# EAGLE design DECADE-PwmduinoV1 (EAGLE 6.3)
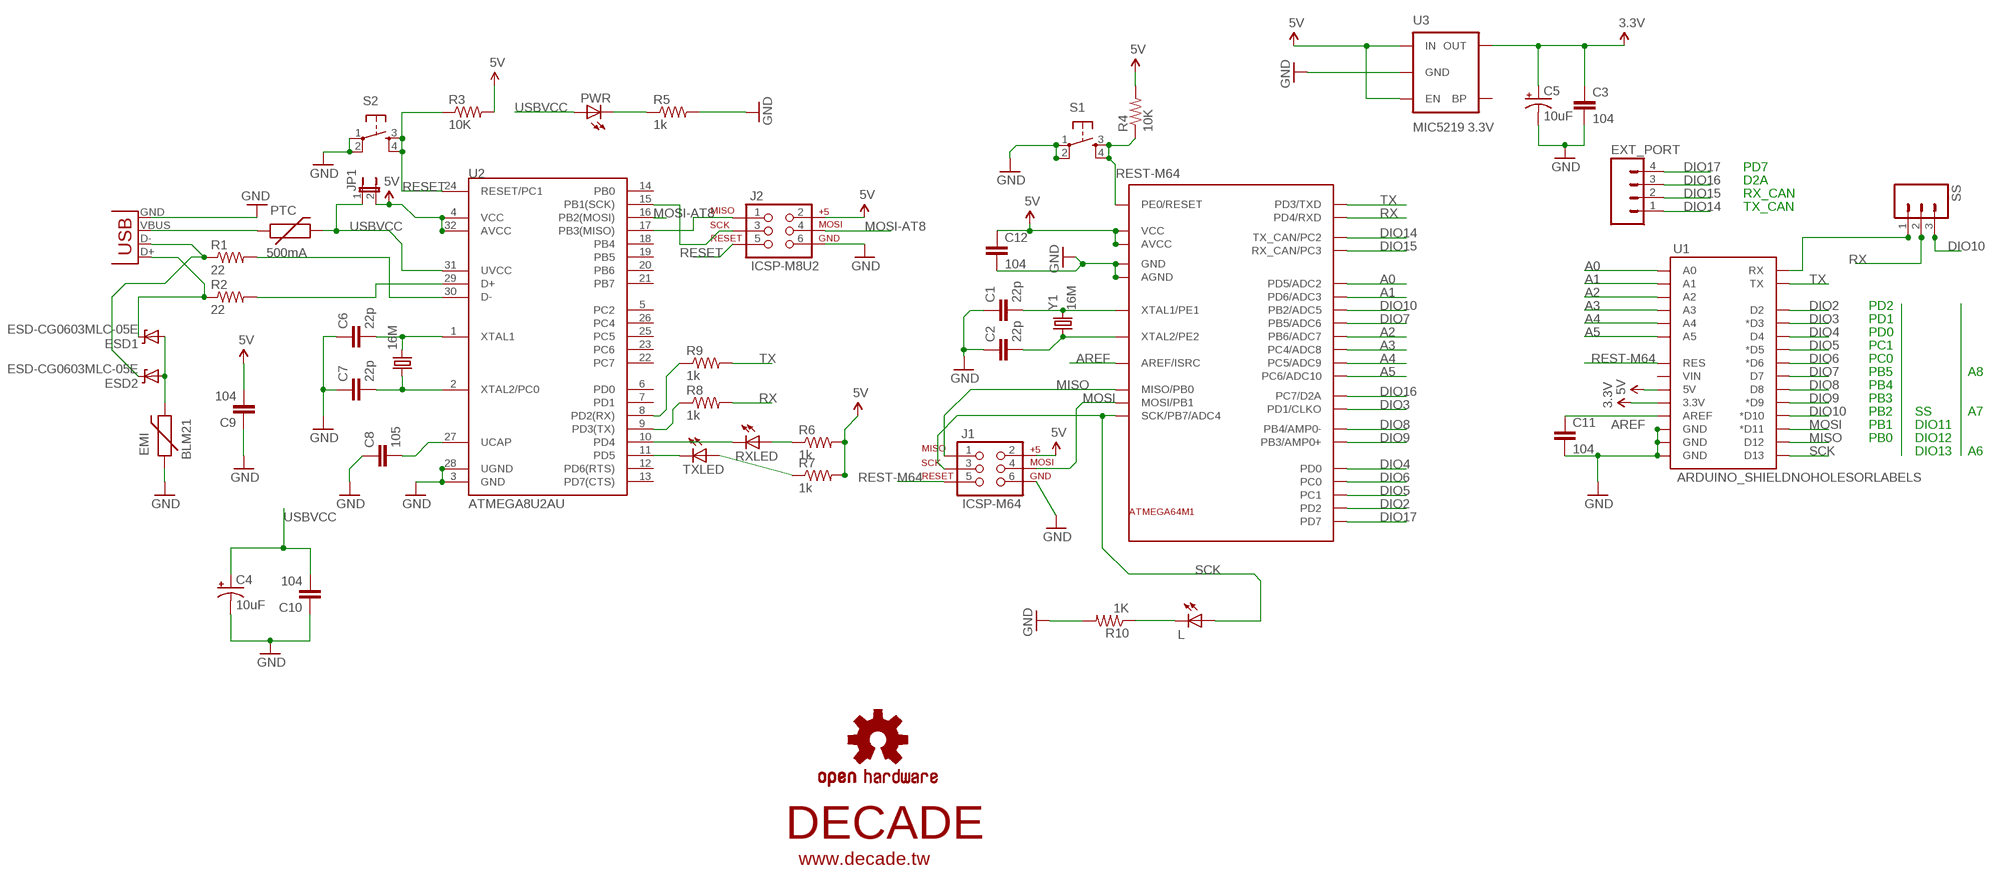
[diagram p0: schematic, sheet 1]

## Parts
16M  CRYSTAL5X3  [CRYSTAL-SMD-5X3]
C1  22p  CAP0603-CAP  [0603-CAP]
C2  22p  CAP0603-CAP  [0603-CAP]
C3  104  CAP0603-CAP  [0603-CAP]
C4  10uF  CAP_POL1206-KIT  [EIA3216-KIT]
C5  10uF  CAP_POL1206-KIT  [EIA3216-KIT]
C6  22p  CAP0603-CAP  [0603-CAP]
C7  22p  CAP0603-CAP  [0603-CAP]
C8  105  CAP0603-CAP  [0603-CAP]
C9  104  CAP0603-CAP  [0603-CAP]
C10  104  CAP0603-CAP  [0603-CAP]
C11  104  CAP0603-CAP  [0603-CAP]
C12  104  CAP0603-CAP  [0603-CAP]
EMI  BLM21  PTCSMD  [PTC-1206]
ESD1  ESD-CG0603MLC-05E  DIODE-ZENER-BZT52  [SOD-323]
ESD2  ESD-CG0603MLC-05E  DIODE-ZENER-BZT52  [SOD-323]
EXT_PORT  M04LOCK  [1X04_LOCK]
J1  ICSP-M64  AVR_SPI_PRG_62X3_LOCK  [2X3_LOCK]
J2  ICSP-M8U2  AVR_SPI_PRG_62X3_LOCK  [2X3_LOCK]
JP1  JUMPER-2SMD-NO  [SJ_2S-NO]
L  LEDCHIP-LED0603  [CHIP-LED0603]
LOGO1  OSHW-LOGOL  [OSHW-LOGO-L]
PTC  500mA  SPARKFUN_PTCSMD  [SPARKFUN_PTC-1206]
PWR  LEDCHIP-LED0603  [CHIP-LED0603]
R1  22  SPARKFUN_RESISTOR0603-RES  [SPARKFUN_0603-RES]
R2  22  SPARKFUN_RESISTOR0603-RES  [SPARKFUN_0603-RES]
R3  10K  SPARKFUN_RESISTOR0603-RES  [SPARKFUN_0603-RES]
R4  10K  SPARKFUN_RESISTOR0603-RES  [SPARKFUN_0603-RES]
R5  1k  SPARKFUN_RESISTOR0603-RES  [SPARKFUN_0603-RES]
R6  1k  SPARKFUN_RESISTOR0603-RES  [SPARKFUN_0603-RES]
R7  1k  SPARKFUN_RESISTOR0603-RES  [SPARKFUN_0603-RES]
R8  1k  SPARKFUN_RESISTOR0603-RES  [SPARKFUN_0603-RES]
R9  1k  SPARKFUN_RESISTOR0603-RES  [SPARKFUN_0603-RES]
R10  1K  SPARKFUN_RESISTOR0603-RES  [SPARKFUN_0603-RES]
RXLED  LEDCHIP-LED0603  [CHIP-LED0603]
S1  TAC_SWITCHPTH  [TACTILE-PTH]
S2  TAC_SWITCHSMD  [TACTILE_SWITCH_SMD]
SS  M03LOCK  [1X03_LOCK]
TXLED  LEDCHIP-LED0603  [CHIP-LED0603]
U1  ARDUINO_SHIELDNOHOLESORLABELS  [DUEMILANOVE_SHIELD_NOHOLES_NOLABELS]
U2  ATMEGA8U2AU  [TQFP32-08]
U3  MIC5219 3.3V  V_REG_MIC52193.3V  [SOT23-5]
U$1  DECADE-ATMEGA64M1  [DECADE-QFN-32]
U$2  DECADE-LOGO-SMALL  [DECADE-LOGO-SMALL]
X1  SPARKFUN_USBOLD  [SPARKFUN_USB-MINIB-OLD]
Y1  16M  CRYSTAL5X3  [CRYSTAL-SMD-5X3]

## Nets
3.3V: C3.1 C5.A(+) U1.3.3V U3.5(OUT)
5V: C9.2 C12.1 J1.2 J2.2 JP1.2 R3.2 R4.2 R6.2 R7.2 U1.5V U2.4(VCC) U2.32(AVCC) U3.1(IN) U3.3(EN) U$1.4(VCC) U$1.19(AVCC)
A0: U1.A0 U$1.13(PD5/ADC2)
A1: U1.A1 U$1.14(PD6/ADC3)
A2: U1.A2 U$1.27(PB6/ADC7)
A3: U1.A3 U$1.17(PC4/ADC8)
A4: U1.A4 U$1.18(PC5/ADC9)
A5: U1.A5 U$1.22(PC6/ADC10)
AREF: C11.1 U1.AREF U$1.21(AREF/ISRC)
DIO2: U1.D2 U$1.1(PD2)
DIO3: U1.D3(*D3) U$1.32(PD1/CLKO)
DIO4: U1.D4 U$1.29(PD0)
DIO5: U1.D5(*D5) U$1.3(PC1)
DIO6: U1.D6(*D6) U$1.30(PC0)
DIO7: U1.D7 U$1.26(PB5/ADC6)
DIO8: U1.D8 U$1.24(PB4/AMP0-)
DIO9: U1.D9(*D9) U$1.23(PB3/AMP0+)
DIO10: SS.3 U1.D10(*D10) U$1.16(PB2/ADC5)
DIO14: EXT_PORT.1 U$1.6(TX_CAN/PC2)
DIO15: EXT_PORT.2 U$1.7(RX_CAN/PC3)
DIO16: EXT_PORT.3 U$1.25(PC7/D2A)
DIO17: EXT_PORT.4 U$1.15(PD7)
GND: C1.1 C2.1 C3.2 C4.C(-) C5.C(-) C6.1 C7.1 C8.1 C9.1 C10.1 C11.2 C12.2 EMI.1 J1.6 J2.6 R5.2 R10.2 S1.1 S1.2 S2.1 S2.2 U1.GND@0(GND) U1.GND@1(GND) U1.GND@2(GND) U2.3(GND) U2.28(UGND) U3.2(GND) U$1.5(GND) U$1.20(AGND) X1.GND
MISO: J1.1 U1.D12 U$1.8(MISO/PB0)
MOSI: J1.4 U1.D11(*D11) U$1.9(MOSI/PB1)
MOSI-AT8: J2.4 U2.16(PB2(MOSI))
N$1: PTC.1 X1.VBUS
N$2: 16M.3 C6.2 U2.1(XTAL1)
N$3: 16M.1 C7.2 U2.2(XTAL2/PC0)
N$4: EMI.2 ESD1.2(A) ESD2.2(A)
N$5: ESD2.1(C) R1.1 X1.D-
N$6: ESD1.1(C) R2.1 X1.D+
N$7: R1.2 U2.30(D-)
N$8: R2.2 U2.29(D+)
N$9: C2.2 U$1.11(XTAL2/PE2) Y1.1
N$10: C8.2 U2.27(UCAP)
N$11: C1.2 U$1.10(XTAL1/PE1) Y1.3
N$12: J2.1 U2.17(PB3(MISO))
N$13: J2.3 U2.15(PB1(SCK))
N$14: PWR.C R5.1
N$15: TXLED.C U2.11(PD5)
N$19: RXLED.C U2.10(PD4)
N$20: R6.1 RXLED.A
N$21: R7.1 TXLED.A
N$23: R9.1 U2.8(PD2(RX))
N$24: R8.1 U2.9(PD3(TX))
N$25: SS.1 U1.RX
N$45: L.C R10.1
RESET: J2.5 R3.1 S2.3 S2.4 U2.24(RESET/PC1)
REST-M64: J1.5 R4.1 S1.3 S1.4 U1.RES U$1.31(PE0/RESET)
RX: R8.2 SS.2 U$1.12(PD4/RXD)
SCK: J1.3 L.A U1.D13 U$1.28(SCK/PB7/ADC4)
TX: R9.2 U1.TX U$1.2(PD3/TXD)
USBVCC: C4.A(+) C10.2 JP1.1 PTC.2 PWR.A U2.31(UVCC)
Unconnected: U1.VIN U2.5(PC2) U2.6(PD0) U2.7(PD1) U2.12(PD6(RTS)) U2.13(PD7(CTS)) U2.14(PB0) U2.18(PB4) U2.19(PB5) U2.20(PB6) U2.21(PB7) U2.22(PC7) U2.23(PC6) U2.25(PC5) U2.26(PC4) U3.4(BP)

## Notes on the sheet
- PD7
- D2A
- RX_CAN
- TX_CAN
- PD2
- PD1
- PD0
- PC1
- PC0
- PB5 | A8
- PB4
- PB3
- PB2 | SS | A7
- PB1 | DIO11
- PB0 | DIO12
- DIO13 | A6

## Library data of the parts
16M Y1 = SparkFun-FreqCtrl:CRYSTAL: Various standard crystals. Proven footprints. Spark Fun Electronics SKU : COM-00534
C1-C3 C6-C12 = SparkFun-Capacitors:CAP: Capacitor Standard 0603 ceramic capacitor, and 0.1" leaded capacitor.
C4 C5 = SparkFun-Capacitors:CAP_POL: Capacitor Polarized These are standard SMD and PTH capacitors. Normally 10uF, 47uF, and 100uF in electrolytic and tantalum varieties. Always verify the external diameter of the through hole cap, it varies with capacity, voltage, and manufacturer. The EIA devices should be standard.
EMI = SparkFun-PowerIC:PTC: Resettable Fuse PTC Resettable Fuse. Spark Fun Electronics SKU : COM-08357
ESD1 ESD2 = SparkFun-DiscreteSemi:DIODE-ZENER: Zener Diode Production Part - 8199 3.4V Zener Voltage
EXT_PORT = SparkFun-Connectors:M04: Header 4 Standard 4-pin 0.1" header. Use with straight break away headers (SKU : PRT-00116), right angle break away headers (PRT-00553), swiss pins (PRT-00743), machine pins (PRT-00117), and female headers (PRT-00115). Molex polarized connector foot print use with SKU : PRT-08231 with associated crimp pins and housings. 1MM SMD Version SKU: PRT-10208
J1 J2 = SparkFun-Connectors:AVR_SPI_PRG_6: AVR ISP 6 Pin This is the reduced ISP connector for AVR programming. Common on Arduino. This footprint will take up less PCB space and can be used with a 10-pin to 6-pin adapter such as SKU: BOB-08508
JP1 = SparkFun-Passives:JUMPER-2: Jumper Basic 0.1" spaced jumper. Use with breakaway headers.
L PWR RXLED TXLED = led:LED: LED OSRAM: - CHIPLED LG R971, LG N971, LY N971, LG Q971, LY Q971, LO R971, LY R971 LH N974, LH R974 LS Q976, LO Q976, LY Q976 LO Q996 - Hyper CHIPLED LW Q18S LB Q993, LB Q99A, LB R99A - SideLED LS A670, LO A670, LY A670, LG A670, LP A670 LB A673, LV A673, LT A673, LW A673 LH A674 LY A675 LS A676, LA A676, LO A676, LY A676, LW A676 LS A679, LY A679, LG A679 - Hyper Micro SIDELED® LS Y876, LA Y876, LO Y876, LY Y876 LT Y87S - SmartLED LW L88C, LW L88S LB L89C, LB L89S, LG L890 LS L89K, LO L89K, LY L89K LS L896, LA L896, LO L896, LY L896 - TOPLED LS T670, LO T670, LY T670, LG T670, LP T670 LSG T670, LSP T670, LSY T670, LOP T670, LYG T670 LG T671, LOG T671, LSG T671 LB T673, LV T673, LT T673, LW T673 LH T674 LS T676, LA T676, LO T676, LY T676, LB T676, LH T676, LSB T676, LW T676 LB T67C, LV T67C, LT T67C, LS T67K, LO T67K, LY T67K, LW E67C LS E67B, LA E67B, LO E67B, LY E67B, LB E67C, LV E67C, LT E67C LW T67C LS T679, LY T679, LG T679 LS T770, LO T770, LY T770, LG T770, LP T770 LB T773, LV T773, LT T773, LW T773 LH T774 LS E675, LA E675, LY E675, LS T675 LS T776, LA T776, LO T776, LY T776, LB T776 LHGB T686 LT T68C, LB T68C - Hyper Mini TOPLED® LB M676 - Mini TOPLED Santana® LG M470 LS M47K, LO M47K, LY M47K Source: http://www.osram.convergy.de LUXEON: - LUMILED® LXK2-PW12-R00, LXK2-PW12-S00, LXK2-PW14-U00, LXK2-PW14-V00 LXK2-PM12-R00, LXK2-PM12-S00, LXK2-PM14-U00 LXK2-PE12-Q00, LXK2-PE12-R00, LXK2-PE12-S00, LXK2-PE14-T00, LXK2-PE14-U00 LXK2-PB12-K00, LXK2-PB12-L00, LXK2-PB12-M00, LXK2-PB14-N00, LXK2-PB14-P00, LXK2-PB14-Q00 LXK2-PR12-L00, LXK2-PR12-M00, LXK2-PR14-Q00, LXK2-PR14-R00 LXK2-PD12-Q00, LXK2-PD12-R00, LXK2-PD12-S00 LXK2-PH12-R00, LXK2-PH12-S00 LXK2-PL12-P00, LXK2-PL12-Q00, LXK2-PL12-R00 Source: www.luxeon.com KINGBRIGHT: KA-3528ASYC Source: www.kingbright.com
LOGO1 = SparkFun-Aesthetics:OSHW-LOGO: Open Source Hardware Logo This logo indicates the piece of hardware it is found on incorporates a OSHW license and/or adheres to the definition of open source hardware found here: http://freedomdefined.org/OSHW
PTC = DECADE-libraries:SPARKFUN_PTC: Resettable Fuse PTC Resettable Fuse. Spark Fun Electronics SKU : COM-08357
R1-R10 = DECADE-libraries:SPARKFUN_RESISTOR: Resistor Basic schematic elements and footprints for 0603, 1206, and PTH resistors.
S1 = SparkFun-Electromechanical:TAC_SWITCH: Momentary Switch Button commonly used for reset or general input. Spark Fun Electronics SKU : COM-00097 SMT- SWCH-08247
S2 = SparkFun-Electromechanical:TAC_SWITCH: Momentary Switch Button commonly used for reset or general input. Spark Fun Electronics SKU : COM-00097 SMT- SWCH-08247; PROD_ID: SWCH-08247
SS = SparkFun-Connectors:M03: Header 3 Standard 3-pin 0.1" header. Use with straight break away headers (SKU : PRT-00116), right angle break away headers (PRT-00553), swiss pins (PRT-00743), machine pins (PRT-00117), and female headers (PRT-00115). Molex polarized connector foot print use with SKU : PRT-08232 with associated crimp pins and housings.
U1 = SparkFun-Boards:ARDUINO_SHIELD: Arduino shield footprint
U2 = SparkFun-DigitalIC:ATMEGA8U2: Atmel 32-pin 8-bit Microcontroller with 8/16/32K Bystes of ISP Flash and USB Controller. ATmega8U2, ATmega16U2, and ATmega32U2
U3 = SparkFun-PowerIC:V_REG_MIC5219: V_REG MIC5219 Standard 500mA LDO voltage regulator in SOT-23 layout. Micrel part MIC5219. BP (by-pass) pin is used to lower output noise with 470pF cap, may be left open.; PROD_ID: VREG-09872
U$1 = DECADE-libraries:DECADE-ATMEGA64M1
U$2 = DECADE-libraries:DECADE-LOGO-SMALL
X1 = DECADE-libraries:SPARKFUN_USB: USB Connectors USB-B-PTH is fully proven SKU : PRT-00139 USB-miniB is fully proven SKU : PRT-00587 USB-A-PCB is untested. USB-A-H is throughly reviewed, but untested. Spark Fun Electronics SKU : PRT-00437 USB-B-SMT is throughly reviewed, but untested. Needs silkscreen touching up. USB-A-S has not been used/tested USB-MB-H has not been used/tested

## Board
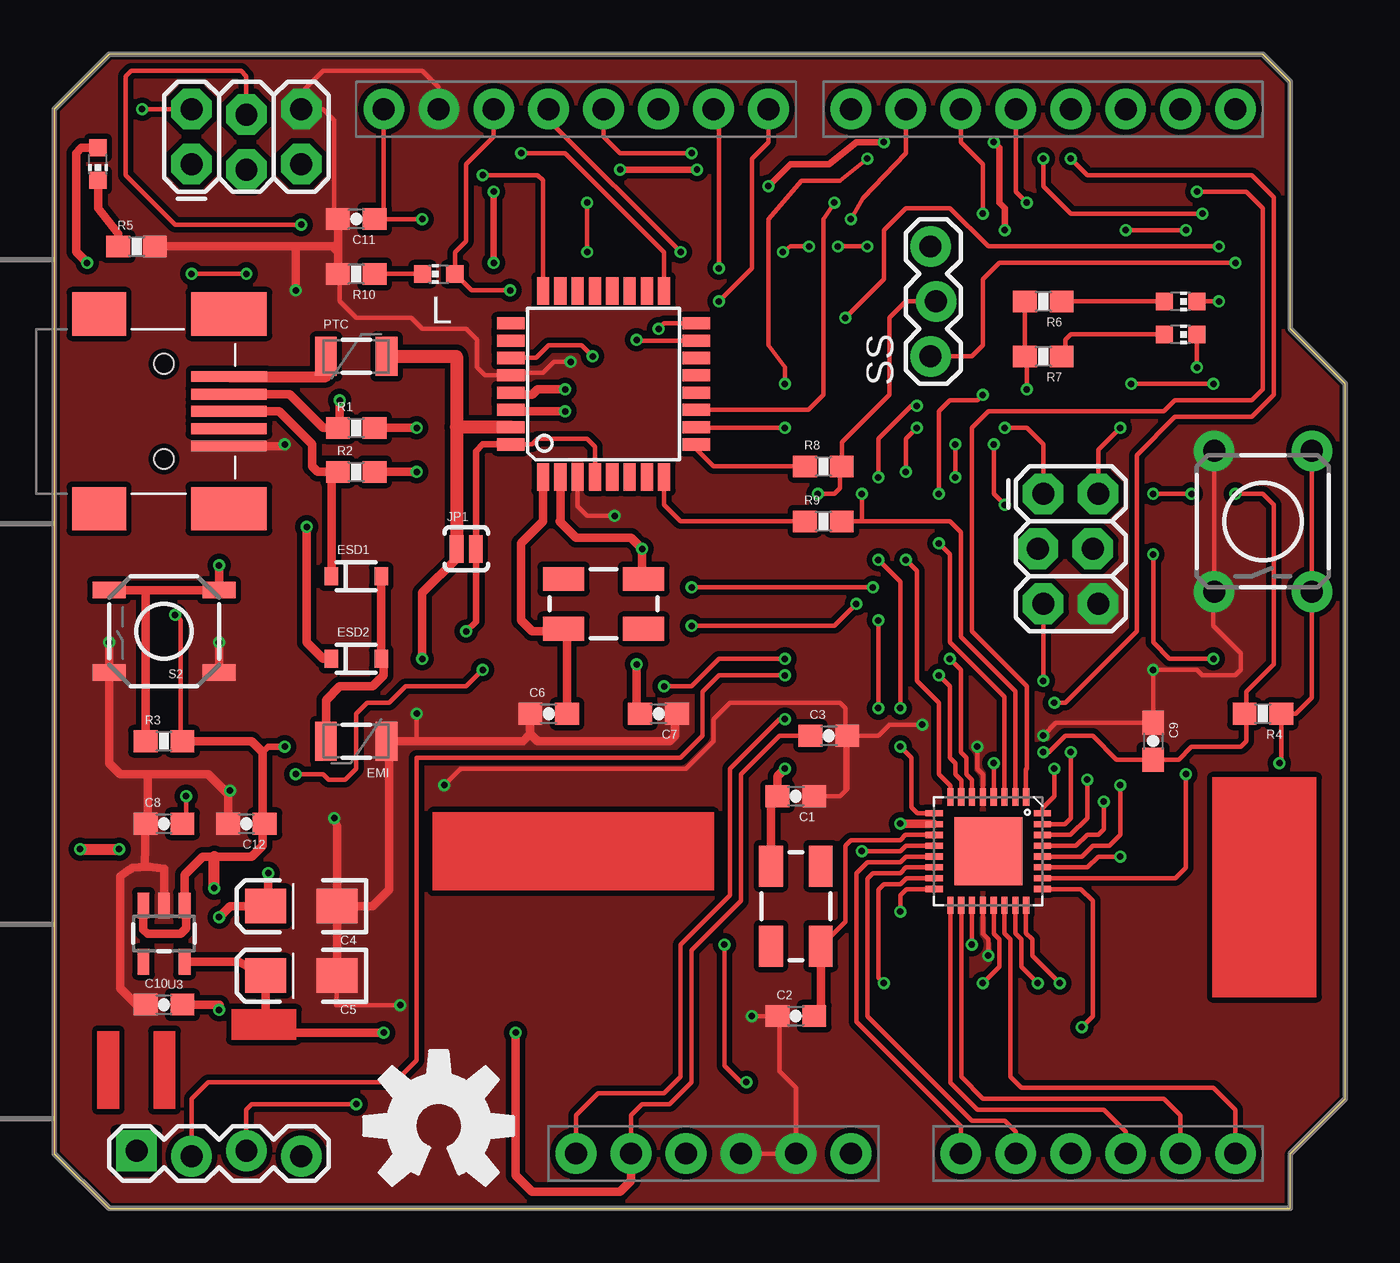
[diagram p1: board, top side]
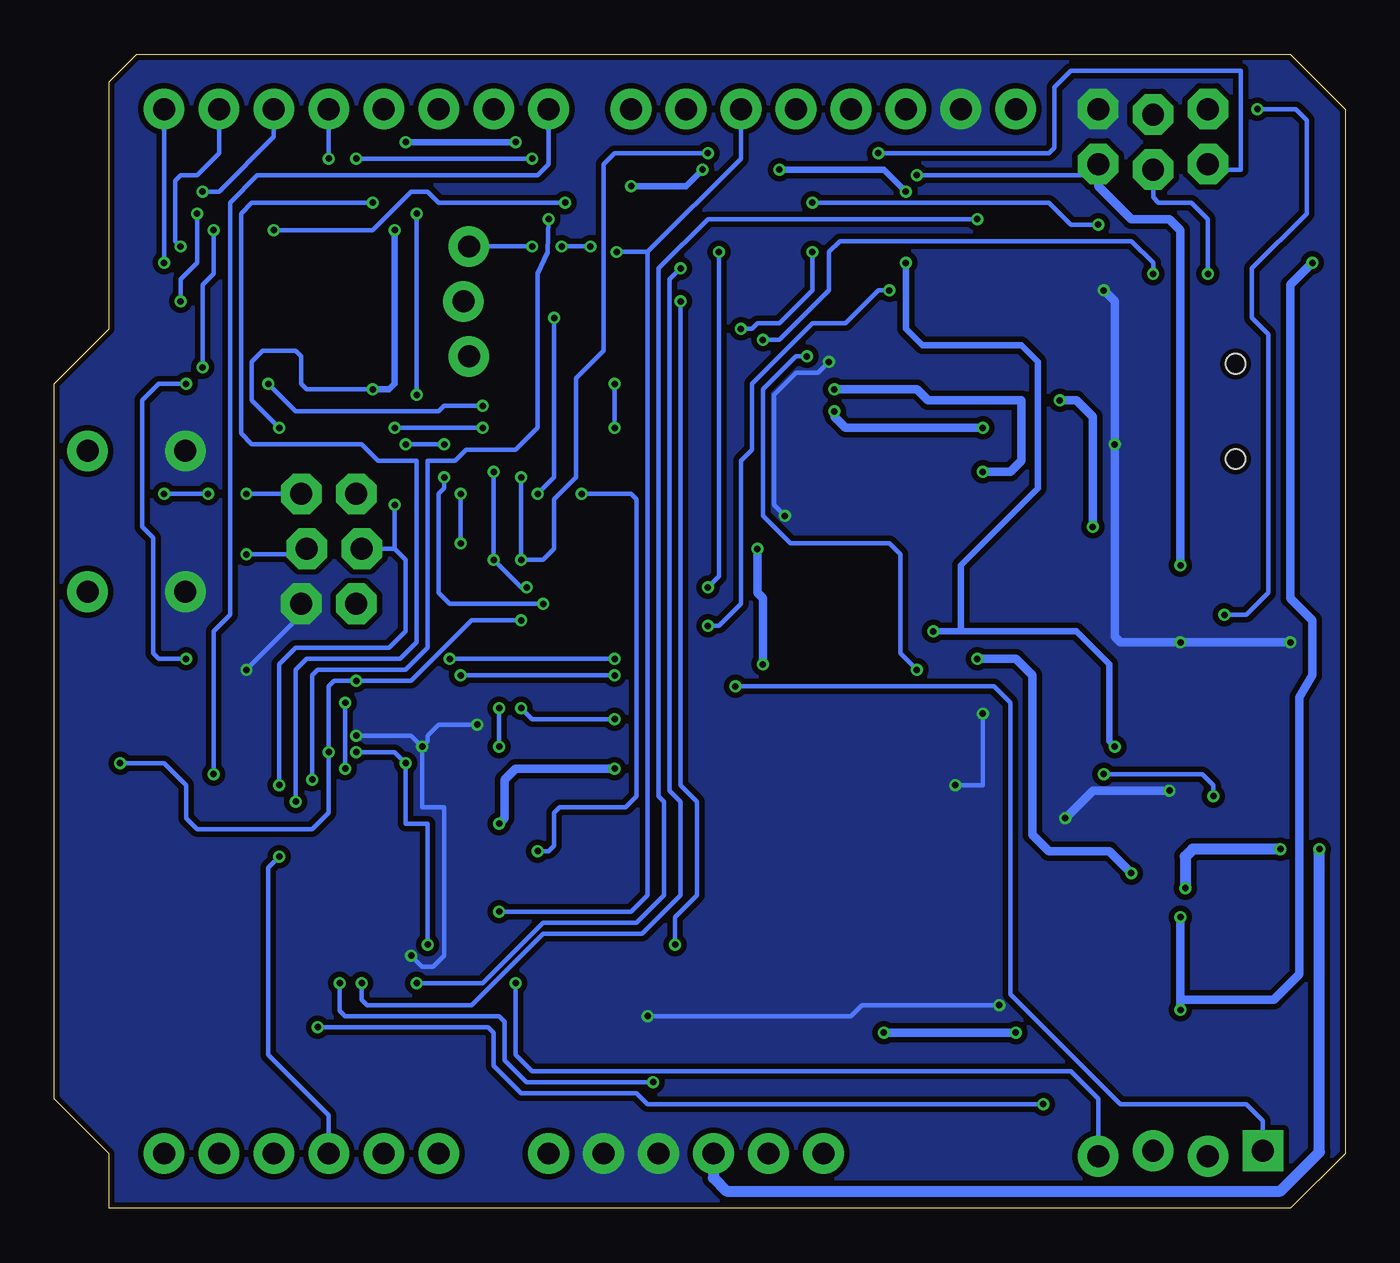
[diagram p2: board, bottom side, seen from below]

Size 59.69 x 53.34 mm. Coordinates in mm from the lower left corner, seen from the top.
Outline: 0,2.54 2.54,0 57.15,0 57.15,2.54 59.69,5.08 59.69,38.1 57.15,40.64 57.15,52.07 55.88,53.34 2.54,53.34 0,50.8 0,2.54
Copper layers (1*16): Top 0.035mm / dielectric 1.5mm / Bottom 0.035mm
Design rules "ChinaPCB-2013-4mil *": minimum track width 4mil, minimum drill 8mil, track to track 4mil, track to pad 4mil, pad to pad 4mil, via to via 4mil, smd to smd 4mil, copper to edge 4mil, drill to drill 15mil, minimum pad ring 12mil, minimum via ring 5mil, stop-mask expansion 4mil, vias tented up to drill 12mil, thermal gap 10mil

### Footprints (pad centres in the part's own frame; a part is rotated, then mirrored left to right if it is on the bottom)
CRYSTAL-SMD-5X3 = smd 1.9 x 1.1: 1 -1.85,-1.15; 2 1.85,-1.15; 3 1.85,1.15; 4 -1.85,1.15
0603-CAP = smd 1.1 x 1: 1 -0.85,0; 2 0.85,0
EIA3216-KIT = smd 1.9 x 1.6: A 1.65,0; C -1.65,0
PTC-1206 = smd 1 x 1.8: 1 -1.4,0; 2 1.4,0
SOD-323 = smd 0.63 x 0.83: 1 -1.15,0; 2 1.15,0
1X04_LOCK = drill 1.016 pad 1.88 square: 1 0,0.127 | drill 1.016 pad 1.88: 2 2.54,-0.127; 3 5.08,0.127; 4 7.62,-0.127
2X3_LOCK = drill 1.016 pad 1.88 octagon: 1 0,0; 2 0,2.54; 3 2.54,-0.254; 4 2.54,2.286; 5 5.08,0; 6 5.08,2.54
SJ_2S-NO = smd 0.635 x 1.27: 1 -0.45,0; 2 0.45,0
CHIP-LED0603 = smd 0.8 x 0.8: A 0,-0.75; C 0,0.75
SPARKFUN_PTC-1206 = smd 1 x 1.8: 1 -1.4,0; 2 1.4,0
SPARKFUN_0603-RES = smd 1.1 x 1: 1 -0.85,0; 2 0.85,0
TACTILE-PTH = drill 1.016 pad 1.88: 1 -3.251,2.261; 2 3.251,2.261; 3 -3.251,-2.261; 4 3.251,-2.261
TACTILE_SWITCH_SMD = smd 1.524 x 0.762: 1 -2.54,1.905; 2 2.54,1.905; 3 -2.54,-1.905; 4 2.54,-1.905
1X03_LOCK = drill 1.016 pad 1.88: 1 0,0.127; 2 2.54,-0.127; 3 5.08,0.127
DUEMILANOVE_SHIELD_NOHOLES_NOLABELS = drill 1.016 pad 1.88: 3.3V 50.8,26.67; 5V 50.8,29.21; A0 50.8,41.91; A1 50.8,44.45; A2 50.8,46.99; A3 50.8,49.53; A4 50.8,52.07; A5 50.8,54.61; AREF 2.54,15.24; D2 2.54,49.53; D3 2.54,46.99; D4 2.54,44.45; D5 2.54,41.91; D6 2.54,39.37; D7 2.54,36.83; D8 2.54,33.02; D9 2.54,30.48; D10 2.54,27.94; D11 2.54,25.4; D12 2.54,22.86; D13 2.54,20.32; GND@0 50.8,31.75; GND@1 50.8,34.29; GND@2 2.54,17.78; RES 50.8,24.13; RX 2.54,54.61; TX 2.54,52.07; VIN 50.8,36.83
TQFP32-08 = smd 1.27 x 0.559: 1 -4.293,2.8; 2 -4.293,2; 3 -4.293,1.2; 4 -4.293,0.4; 5 -4.293,-0.4; 6 -4.293,-1.2; 7 -4.293,-2; 8 -4.293,-2.8; 17 4.293,-2.8; 18 4.293,-2; 19 4.293,-1.2; 20 4.293,-0.4; 21 4.293,0.4; 22 4.293,1.2; 23 4.293,2; 24 4.293,2.8 | smd 0.559 x 1.27: 9 -2.8,-4.293; 10 -2,-4.293; 11 -1.2,-4.293; 12 -0.4,-4.293; 13 0.4,-4.293; 14 1.2,-4.293; 15 2,-4.293; 16 2.8,-4.293; 25 2.8,4.293; 26 2,4.293; 27 1.2,4.293; 28 0.4,4.293; 29 -0.4,4.293; 30 -1.2,4.293; 31 -2,4.293; 32 -2.8,4.293
SOT23-5 = smd 0.55 x 1.2: 1 -0.95,-1.3; 2 0,-1.3; 3 0.95,-1.3; 4 0.95,1.3; 5 -0.95,1.3
DECADE-QFN-32 = smd 0.285 x 0.8: 1 -1.75,-2.5; 2 -1.25,-2.5; 3 -0.75,-2.5; 4 -0.25,-2.5; 5 0.25,-2.5; 6 0.75,-2.5; 7 1.25,-2.5; 8 1.75,-2.5; 17 1.75,2.5; 18 1.25,2.5; 19 0.75,2.5; 20 0.25,2.5; 21 -0.25,2.5; 22 -0.75,2.5; 23 -1.25,2.5; 24 -1.75,2.5 | smd 0.8 x 0.285: 9 2.5,-1.75; 10 2.5,-1.25; 11 2.5,-0.75; 12 2.5,-0.25; 13 2.5,0.25; 14 2.5,0.75; 15 2.5,1.25; 16 2.5,1.75; 25 -2.5,1.75; 26 -2.5,1.25; 27 -2.5,0.75; 28 -2.5,0.25; 29 -2.5,-0.25; 30 -2.5,-0.75; 31 -2.5,-1.25; 32 -2.5,-1.75 | smd 3.15 x 3.15: EP 0,0
SPARKFUN_USB-MINIB-OLD = smd 2.5 x 2: 1 -3,-4.5; 2 -3,4.5 | smd 3.5 x 2: 3 3,-4.5; 4 3,4.5 | smd 3.5 x 0.5: D+ 3,0; D- 3,0.8; GND 3,-1.6; ID 3,-0.8; VBUS 3.01,1.61 | hole 0.9: 0,2.2; 0,-2.2

### Placement (x,y rotation side)
16M  25.4,27.94 180 top
C1  34.29,19.05 180 top
C2  34.29,8.89 0 top
C3  35.81,21.84 0 top
C4  11.43,13.97 180 top
C5  11.43,10.76 180 top
C6  22.86,22.86 0 top
C7  27.94,22.86 180 top
C8  5.08,17.78 0 top
C9  50.8,21.59 270 top
C10  5.08,9.42 0 top
C11  13.97,45.72 180 top
C12  8.89,17.78 180 top
EMI  13.97,21.59 180 top
ESD1  13.97,29.21 0 top
ESD2  13.97,25.4 0 top
EXT_PORT  3.81,2.54 0 top
J1  45.72,33.02 270 top
J2  6.35,48.26 0 top
JP1  19.05,30.48 0 top
L  17.78,43.18 90 top
LOGO1  17.78,3.81 0 top
PTC  13.97,39.37 0 top
PWR  2.03,48.26 180 top
R1  13.97,36.07 0 top
R2  13.97,34.04 0 top
R3  5.08,21.59 0 top
R4  55.88,22.86 180 top
R5  3.81,44.45 0 top
R6  45.72,41.91 180 top
R7  45.72,39.37 180 top
R8  35.56,34.29 0 top
R9  35.56,31.75 0 top
R10  13.97,43.18 180 top
RXLED  52.07,41.91 270 top
S1  55.88,31.75 90 top
S2  5.08,26.67 180 top
SS  40.64,39.37 90 top
TXLED  52.07,40.39 270 top
U1  0,53.34 270 top
U2  25.4,38.1 90 top
U3  5.08,12.7 180 top
U$1  43.18,16.51 180 top
U$2  58.42,9.79 90 top
X1  5.08,36.83 0 top
Y1  34.29,13.97 90 top

### Tracks (layer width: path | path; a pad name or v marks a point on that pad's centre or on a via)
3.3V  (via drill 0.3 pad 0.5)
  Top 0.2: C3.1 33.53,21.84 31.75,20.07 31.75,14.22 29.46,11.94 29.46,5.84 28.45,4.83 27.18,4.83 26.67,4.32 U1.3.3V
  Top 0.4: U3.5 8.54,11.4 C5.A 9.78,8.51 10.16,8.13 v15.24,8.13 | v21.34,8.13 21.34,1.52 22.1,0.76 26.16,0.76 26.67,1.27 U1.3.3V
  Bottom 0.4: v15.24,8.13 v21.34,8.13
5V  (via drill 0.3 pad 0.5)
  Top 0.2: U$1.19 42.43,12.2 v42.42,12.19 | v43.43,20.57 U$1.4 | v45.72,21.08 45.97,21.08 46.74,21.84 48.01,21.84 49.11,20.74 C9.2 51.98,20.74 52.58,21.34 54.86,21.34 55.12,21.59 55.12,22.77 R4.2 55.12,22.95 55.12,23.88 56.39,25.15 56.39,32.51 55.88,33.02 v54.61,33.02 | R6.2 R7.2 44.96,39.28 v44.96,37.85 | J1.2 48.26,35.05 v49.28,36.07 | v50.8,33.02 v52.58,33.02 | U2.4 25,35.2 24.64,35.56 22.35,35.56 22.1,35.31 U2.32 | J2.2 v4.06,50.8 | v5.59,27.43 5.84,27.18 5.84,21.68 R3.2
  Top 0.3: U2.32 19.81,35.31 19.5,34.99 JP1.2 19.5,27.12 v19.05,26.67 | v10.67,21.34 9.91,21.34 9.65,21.08 | v43.94,45.21 43.94,46.23 43.69,46.48 43.69,49.02 v43.43,49.28 | v38.35,49.28 37.08,49.28 35.81,48.26 34.04,48.26 v33.02,47.24 | v29.72,48.01 v26.16,48.01 | v20.32,46.99 v20.32,43.69
  Top 0.4: R3.2 9.14,21.59 9.65,21.08 9.65,17.87 C12.1 9.65,17.69 9.65,16.76 9.14,16.26 7.4,16.26 6.86,16.26 6.03,15.43 U3.1 6.1,13.93 6.1,12.95 5.84,12.7 4.32,12.7 4.13,12.89 U3.3
  Top 0.5: v1.2,16.6 v3,16.6 | v7.4,14.8 7.4,16.26
  Bottom 0.2: v42.42,12.19 42.42,17.78 43.43,17.78 v43.43,20.57 43.94,21.08 v45.72,21.08 | v49.28,36.07 50.55,37.34 50.55,39.12 50.04,39.62 48.51,39.62 48.26,39.37 48.26,38.1 48.01,37.85 v44.96,37.85 | J1.2 v50.8,33.02 | v52.58,33.02 v54.61,33.02 | v4.06,50.8 2.29,50.8 1.78,50.29 1.78,45.97 4.32,43.43 4.32,41.15 3.56,40.39 3.56,28.45 4.57,27.43 v5.59,27.43
  Bottom 0.3: v19.05,26.67 17.78,26.67 | 17.78,26.67 12.45,26.67 10.92,25.15 10.92,21.59 v10.67,21.34 | v44.96,37.85 44.2,37.85 43.94,38.1 v43.94,45.21 | v43.43,49.28 v38.35,49.28 | v33.02,47.24 30.48,47.24 v29.72,48.01 | v26.16,48.01 21.34,48.01 v20.32,46.99 | v20.32,43.69 20.32,40.64 19.56,39.88 14.99,39.88 14.22,39.12 14.22,33.27 17.78,29.72 17.78,26.67
  Bottom 0.5: U1.5V 29.21,1.41 28.6,0.8 3,0.8 1.2,2.6 v1.2,16.6 | v3,16.6 7.06,16.6 7.4,16.26 v7.4,14.8
A0
  Top 0.2: U$1.13 39.37,16.26 39.12,16 37.59,16 37.08,15.49 37.08,8.64 41.91,3.81 U1.A0
A1
  Top 0.2: U$1.14 39.38,15.76 39.12,15.49 37.85,15.49 37.59,15.24 37.59,8.89 42.42,4.06 43.94,4.06 44.45,3.56 U1.A1
A2  (via drill 0.3 pad 0.5)
  Top 0.2: U$1.27 47.76,15.76 48.26,16.26 v49.28,16.26
  Bottom 0.2: v49.28,16.26 49.78,15.75 49.78,7.11 46.99,4.32 U1.A2
A3
  Top 0.2: U$1.17 41.43,5.81 42.67,4.57 48.51,4.57 49.53,3.56 U1.A3
A4
  Top 0.2: U$1.18 41.93,6.08 42.93,5.08 51.31,5.08 52.07,4.32 U1.A4
A5
  Top 0.2: U$1.22 43.93,12.71 44.2,12.45 44.2,6.1 44.7,5.59 53.59,5.59 54.61,4.57 U1.A5
AREF  (via drill 0.3 pad 0.5)
  Top 0.2: U$1.21 43.43,12.7 43.69,12.45 43.69,11.18 v42.93,10.41 | v17.02,45.72 C11.1 15.24,46.14 U1.AREF
  Bottom 0.2: v42.93,10.41 39.88,10.41 37.08,13.21 32.77,13.21 31.5,14.48 31.5,18.8 31.75,19.05 31.75,43.43 29.46,45.72 v17.02,45.72
DIO2  (via drill 0.3 pad 0.5)
  Top 0.2: U$1.1 44.93,20.29 44.96,20.32 44.96,24.13 42.42,26.67 42.42,36.07 43.18,36.83 51.31,36.83 51.82,37.34 55.37,37.34 55.88,37.85 55.88,46.23 55.12,46.99 v52.83,46.99
  Bottom 0.2: v52.83,46.99 52.07,46.99 49.53,49.53 U1.D2
DIO3  (via drill 0.3 pad 0.5)
  Top 0.2: U$1.32 45.68,18.5 46.23,19.05 v46.23,20.32 | v46.23,23.37 46.74,23.37 50.04,26.67 50.04,34.8 51.82,36.58 55.37,36.58 56.39,37.59 56.39,46.74 55.37,47.75 47.75,47.75 v46.99,48.51
  Bottom 0.2: v46.23,20.32 v46.23,23.37 | v46.99,48.51 U1.D3
DIO4  (via drill 0.3 pad 0.5)
  Top 0.2: U$1.29 47.24,16.76 47.75,17.27 48.26,17.27 48.51,17.53 v48.51,18.8 | v44.96,46.48 44.45,46.99 U1.D4
  Bottom 0.2: v48.51,18.8 48.51,24.89 48.01,25.4 43.69,25.4 42.93,26.16 42.93,34.54 44.7,34.54 45.47,35.31 50.55,35.31 51.05,35.81 51.05,45.97 50.55,46.48 v44.96,46.48
DIO5  (via drill 0.3 pad 0.5)
  Top 0.2: U$1.3 43.93,23.63 41.4,26.16 41.4,30.23 v40.89,30.73 | v40.89,33.02 40.89,36.83 41.4,37.34 42.67,37.34 v42.93,37.59 | v42.93,45.97 42.93,48.26 41.91,49.28 U1.D5
  Bottom 0.2: v40.89,30.73 v40.89,33.02 | v42.93,37.59 v42.93,45.97
DIO6  (via drill 0.3 pad 0.5)
  Top 0.2: U$1.30 46.98,17.26 47.75,18.03 v47.75,19.81 | v36.83,45.72 37.38,46.68 39.37,48.77 U1.D6
  Bottom 0.2: v47.75,19.81 47.75,24.64 47.5,24.89 43.43,24.89 42.42,25.91 42.42,34.54 41.15,34.54 40.64,35.05 38.35,35.05 37.34,36.07 37.34,43.18 36.88,44.19 v36.83,45.72
DIO7  (via drill 0.3 pad 0.5)
  Top 0.2: U$1.26 51.84,15.26 52.32,15.75 v52.32,20.07
  Bottom 0.2: v52.32,20.07 52.32,26.67 51.56,27.43 51.56,46.48 50.29,47.75 37.34,47.75 36.83,48.26 U1.D7
DIO8  (via drill 0.3 pad 0.5)
  Top 0.2: U$1.24 44.93,12.73 45.21,12.45 45.21,11.68 v46.48,10.41 | v32,5.84 31.75,5.84 30.99,6.6 v30.99,12.19 | v30.73,41.91 32.26,43.43 32.26,48.51 33.02,49.28 U1.D8
  Bottom 0.2: v46.48,10.41 46.48,9.14 46.23,8.89 39.12,8.89 38.86,8.64 38.86,6.86 37.85,5.84 v32,5.84 | v30.99,12.19 30.99,13.46 29.97,14.48 29.97,18.8 30.73,19.56 v30.73,41.91
DIO9  (via drill 0.3 pad 0.5)
  Top 0.2: U$1.23 44.43,12.72 44.7,12.45 44.7,11.18 v45.47,10.41 | v30.73,43.43 30.73,50.55 U1.D9
  Bottom 0.2: v45.47,10.41 45.47,9.65 45.21,9.4 40.39,9.4 37.08,12.7 32.51,12.7 30.73,14.48 30.73,18.8 31.24,19.3 31.24,42.93 v30.73,43.43
DIO10  (via drill 0.3 pad 0.5)
  Top 0.2: U$1.16 39.4,14.76 39.12,14.48 v39.12,13.72 | v37.59,44.45 v36.22,44.45 | v34.9,44.45 34.04,44.45 v33.68,44.2
  Bottom 0.2: v39.12,13.72 33.02,13.72 32.26,14.48 32.26,44.2 | 32.26,44.2 27.94,48.51 U1.D10 | SS.3 v37.59,44.45 | v36.22,44.45 v34.9,44.45 | 32.26,44.2 v33.68,44.2
DIO14  (via drill 0.3 pad 0.5)
  Top 0.2: U$1.6 42.43,19.8 42.16,20.07 42.16,20.83 41.91,21.08 41.91,24.89 v41.4,25.4 | v33.78,25.4 30.73,25.4 29.46,24.13 v28.19,24.13
  Bottom 0.2: v41.4,25.4 v33.78,25.4 | v28.19,24.13 16.26,24.13 15.49,23.37 15.49,9.91 10.41,4.83 4.57,4.83 3.81,4.06 EXT_PORT.1
DIO15  (via drill 0.3 pad 0.5)
  Top 0.2: U$1.7 41.93,19.79 41.66,20.07 41.66,20.57 41.4,20.83 41.4,24.13 v40.89,24.64 | v33.78,24.64 30.73,24.64 29.97,23.88 29.97,21.84 28.96,20.83 16.76,20.83 16.76,6.86 15.75,5.84 7.11,5.84 6.35,5.08 EXT_PORT.2
  Bottom 0.2: v40.89,24.64 v33.78,24.64
DIO16  (via drill 0.3 pad 0.5)
  Top 0.2: U$1.25 47.47,14.76 48.01,14.22 48.01,8.89 v47.5,8.38 | v13.97,4.83 9.14,4.83 8.89,4.57 EXT_PORT.3
  Bottom 0.2: v47.5,8.38 39.62,8.38 39.37,8.13 39.37,6.6 38.1,5.33 32.77,5.33 32.26,4.83 v13.97,4.83
DIO17  (via drill 0.3 pad 0.5)
  Top 0.2: U$1.15 39.39,15.26 39.12,14.99 38.35,14.99 38.1,14.73 38.1,10.67 v38.35,10.41
  Bottom 0.2: v38.35,10.41 38.35,7.11 37.59,6.35 12.7,6.35 11.43,5.08 EXT_PORT.4
GND  (via drill 0.3 pad 0.5)
  Top 0.2: U$1.20 42.93,12.7 43.18,12.45 v43.18,11.68 | v42.67,21.34 42.67,20.32 42.93,20.07 U$1.5 | U1.GND@2 17.78,51.82 17.02,52.58 12.45,52.58 11.43,51.56 J2.6 12.45,50.8 12.95,50.29 12.95,45.89 C11.2 | S1.2 S1.1 53.59,28.47 53.59,26.92 54.86,25.65 54.86,24.89 54.61,24.64 53.09,24.64 52.83,24.89 v50.8,24.89 C9.1 46.32,22.44 v45.72,21.84 | C3.2 36.66,21.68 | 36.58,19.3 36.66,19.39 36.66,21.68 | 36.66,21.68 36.83,21.84 38.1,21.84 38.61,22.35 v40.13,22.35 | C1.1 36.32,19.05 36.58,19.3 | 36.58,19.3 36.58,23.11 36.32,23.37 31.24,23.37 30.48,22.61 30.48,21.59 29.21,20.32 18.8,20.32 v18.03,19.56 | v16.76,22.86 16.76,21.59 | U1.GND@0 U1.GND@1 34.29,5.59 33.53,6.35 33.53,8.8 C2.1 v32.26,8.89 | v16,9.4 13.04,9.4 C5.C | U2.3 24.2,32.44 24.64,32 v25.91,32 | v23.88,39.12 23.11,39.12 22.61,38.61 21.21,38.61 U2.28 19.92,38.5 19.56,38.86 19.56,40.13 19.05,40.64 17.02,40.64 16.51,41.15 13.97,41.15 13.21,41.91 13.21,43.09 R10.2
  Top 0.4: C6.1 22.01,21.93 | 22.01,21.93 22.35,21.59 28.45,21.59 28.7,21.84 28.7,22.77 C7.1 | R10.2 13.12,44.2 | 13.12,44.2 C11.2 | R5.2 11.18,44.45 | 11.18,44.45 12.87,44.45 13.12,44.2 | X1.GND 10.59,35.23 v10.67,35.31 | v11.18,42.42 11.18,44.45 | v2.54,26.16 S2.2 2.54,20.57 3.05,20.07 4.32,20.07 | v7.62,26.16 S2.1 | 3.63,15.74 4.2,15.8 C8.1 4.32,17.87 4.32,20.07 | 3.63,15.74 4.4,15.8 5.08,15.69 U3.2 | C5.C C4.C | C10.1 3.81,9.42 3.05,10.18 3.05,15.36 3.4,15.6 3.63,15.74 | C4.C 14.73,13.97 15.49,14.73 15.49,21.47 EMI.1 16.76,21.59 21.67,21.59 22.01,21.93 | C12.2 8.04,19.14 | 8.04,19.14 7.11,20.07 4.32,20.07 | C4.C 13.08,17.65 v12.95,18.03 | v8.13,19.3 8.21,19.3 8.04,19.14
  Bottom 0.2: v43.18,11.68 42.67,11.18 42.16,11.18 41.66,11.68 41.66,18.54 42.67,18.54 v42.67,21.34 | J1.6 48.26,27.43 v50.8,24.89 | v45.72,21.84 43.18,21.84 v42.67,21.34 | v40.13,22.35 41.91,22.35 42.42,21.84 42.42,21.59 v42.67,21.34 | v18.03,19.56 16.76,19.56 v16.76,22.86 | v32.26,8.89 22.86,8.89 22.35,9.4 v16,9.4 | v25.91,32 26.42,32.51 26.42,37.59 25.4,38.61 24.38,38.61 v23.88,39.12
  Bottom 0.4: v11.18,42.42 10.67,41.91 v10.67,35.31 10.67,26.42 10.41,26.16 v7.62,26.16 v2.54,26.16 | v12.95,18.03 11.68,19.3 v8.13,19.3
  pour Top (isolate 0.254, no thermals): 2.54,53.34 0,50.8 0,2.54 2.54,0 57.15,0 57.15,2.54 59.69,5.08 59.69,38.1 57.15,40.64 57.15,52.07 55.88,53.34
  pour Bottom (isolate 0.254, no thermals): 2.54,53.34 0,50.8 0,2.54 2.54,0 57.15,0 57.15,2.54 59.69,5.08 59.69,38.1 57.15,40.64 57.15,52.07 55.88,53.34
MISO  (via drill 0.3 pad 0.5)
  Top 0.2: U$1.8 41.43,19.53 40.89,20.07 40.89,23.37 39.88,24.38 39.88,29.46 v39.37,29.97 | v39.37,34.04 39.37,35.56 v39.88,36.07 | v43.94,36.07 44.96,36.07 45.72,35.31 J1.1 | U1.D12 22.86,50.29 v28.96,44.2 | v29.46,28.7 v37.85,28.7
  Bottom 0.2: v39.37,34.04 v39.37,29.97 38.1,28.7 v37.85,28.7 | v39.88,36.07 v43.94,36.07 | v28.96,44.2 28.96,29.21 v29.46,28.7
MOSI  (via drill 0.3 pad 0.5)
  Top 0.2: U$1.9 39.91,18.26 39.62,18.54 39.62,20.83 v39.12,21.34 | v39.12,23.11 39.12,28.96 v38.1,29.97 | v38.1,33.78 38.1,35.56 39.62,37.08 v39.88,37.08 | v49.78,38.1 v53.59,38.1 | v53.59,25.4 51.56,25.4 50.8,26.16 v50.8,30.23 | U1.D11 25.4,49.53 26.16,48.77 v29.46,48.77
  Bottom 0.2: v39.12,21.34 v39.12,23.11 | v38.1,33.78 v38.1,29.97 37.08,29.97 36.58,30.48 36.58,32.77 35.56,33.78 35.56,38.35 34.29,39.62 34.29,48.26 33.78,48.77 v29.46,48.77 | v39.88,37.08 41.66,37.08 41.91,36.83 48.51,36.83 v49.78,38.1 | v53.59,38.1 54.86,38.1 55.63,37.34 55.63,31.5 55.12,30.99 55.12,25.65 54.86,25.4 v53.59,25.4 | v50.8,30.23 48.51,30.23 J1.4
MOSI-AT8  (via drill 0.3 pad 0.5)
  Top 0.2: U2.16 28.2,40.9 v27.94,40.64 | v24.64,44.2 v24.64,46.48 | v11.43,45.47 5.59,45.47 3.3,47.75 3.3,52.32 3.56,52.58 8.64,52.58 8.89,52.32 J2.4
  Bottom 0.2: v27.94,40.64 27.43,40.64 27.18,40.89 26.16,40.89 24.64,42.42 v24.64,44.2 | v24.64,46.48 13.72,46.48 12.7,45.47 v11.43,45.47
N$1
  Top 0.5: X1.VBUS 12.57,38.44 PTC.1
N$2
  Top 0.4: U2.1 22.6,31.74 21.59,30.73 21.59,27.18 22.1,26.67 23.43,26.67 16M.3 23.71,26.63 C6.2
N$3  (via drill 0.3 pad 0.5)
  Top 0.4: U2.2 23.4,31.78 23.37,31.75 24.13,30.99 26.67,30.99 26.8,30.86 v27.18,30.48 27.18,29.16 16M.1 | C7.2 27.09,22.95 26.92,23.11 v26.92,25.15
  Bottom 0.4: v26.92,25.15 26.92,28.19 27.18,28.45 v27.18,30.48
N$4
  Top 0.4: ESD1.2 ESD2.2 15.24,25.28 15.24,24.64 14.73,24.13 13.21,24.13 12.57,23.49 EMI.2
N$5  (via drill 0.3 pad 0.5)
  Top 0.4: X1.D- 10.88,37.63 12.45,36.07 R1.1 13.21,36.16 v13.21,37.34 | ESD2.1 12.45,25.4 11.68,26.16 v11.68,31.5
  Bottom 0.4: v11.68,31.5 11.68,36.58 12.45,37.34 v13.21,37.34
N$6
  Top 0.4: X1.D+ 10.41,36.83 11.94,35.31 11.94,34.29 12.19,34.04 R2.1 12.82,33.74 ESD1.1
N$7  (via drill 0.3 pad 0.5)
  Top 0.4: R1.2 v16.76,36.07 | v23.62,36.83 21.18,36.83 U2.30
  Bottom 0.4: v16.76,36.07 23.11,36.07 23.62,36.58 v23.62,36.83
N$8  (via drill 0.3 pad 0.5)
  Top 0.4: R2.2 v16.76,34.04 | v23.62,37.85 22.35,37.85 22.1,37.59 21.21,37.59 U2.29
  Bottom 0.4: v16.76,34.04 15.49,34.04 14.99,34.54 14.99,37.34 19.3,37.34 19.81,37.85 v23.62,37.85
N$9
  Top 0.2: U$1.11 39.36,17.26 39.12,17.02 36.83,17.02 36.58,16.76 36.58,13.26 Y1.1
  Top 0.4: Y1.1 35.44,9.19 C2.2
N$10  (via drill 0.3 pad 0.5)
  Top 0.2: U2.27 22.28,39.3 22.86,39.88 24.38,39.88 v24.89,39.37 | v19.81,24.89 19.05,24.13 16.26,24.13 15.49,23.37 14.48,23.37 13.97,22.86 13.97,20.32 13.46,19.81 12.7,19.81 12.45,20.07 v11.18,20.07 | C8.2 5.93,17.87 6.1,18.03 v6.1,19.05
  Bottom 0.2: v24.89,39.37 25.4,39.37 26.92,37.85 26.92,32 25.65,30.73 21.08,30.73 20.57,30.23 20.57,25.65 v19.81,24.89 | v6.1,19.05 6.1,19.56 6.6,20.07 v11.18,20.07
N$11  (via drill 0.3 pad 0.5)
  Top 0.4: Y1.3 33.14,18.75 C1.2 33.44,19.98 v33.78,20.32 | v39.12,17.78 40.66,17.78 U$1.10
  Bottom 0.4: v33.78,20.32 38.35,20.32 38.86,19.81 38.86,18.03 v39.12,17.78
N$12  (via drill 0.3 pad 0.5)
  Top 0.2: U2.17 28.2,44.19 23.62,48.77 v21.59,48.77
  Bottom 0.2: v21.59,48.77 13.72,48.77 13.46,49.02 13.46,51.82 12.7,52.58 4.83,52.58 4.83,48.01 6.1,48.01 J2.1
N$13  (via drill 0.3 pad 0.5)
  Top 0.2: U2.15 26.96,40.1 v26.92,40.13 | v8.89,43.18 v6.35,43.18
  Bottom 0.2: v26.92,40.13 26.16,40.13 23.88,42.42 23.88,44.2 23.37,44.7 9.91,44.7 8.89,43.69 v8.89,43.18 | v6.35,43.18 6.35,45.72 7.11,46.48 8.64,46.48 8.89,46.74 J2.3
N$14
  Top 0.4: R5.1 2.96,45.05 2.03,46.23 PWR.C
N$15  (via drill 0.3 pad 0.5)
  Top 0.2: U2.11 34.87,36.9 35.56,37.59 35.56,45.72 v36.07,46.48 | v49.53,45.21 v52.32,45.21 | v52.83,38.86 52.83,40.37 TXLED.C
  Bottom 0.2: v36.07,46.48 41.91,46.48 42.42,46.99 43.18,46.99 44.96,45.21 v49.53,45.21 | v52.32,45.21 52.32,43.18 52.83,42.67 v52.83,38.86
N$19  (via drill 0.3 pad 0.5)
  Top 0.2: RXLED.C v53.85,41.91 | v53.09,45.97 46.99,45.97 45.72,47.24 v45.72,48.51 | v37.59,48.51 36.32,47.5 34.54,47.5 33.02,45.72 33.02,39.88 33.78,38.86 v33.78,38.1 | v33.78,36.07 29.73,36.07 U2.10
  Bottom 0.2: v53.85,41.91 53.85,42.93 53.09,43.69 v53.09,45.97 | v45.72,48.51 v37.59,48.51 | v33.78,38.1 v33.78,36.07
N$20
  Top 0.2: R6.1 RXLED.A
N$21
  Top 0.2: TXLED.A 46.99,40.39 46.74,40.13 46.74,39.54 R7.1
N$23
  Top 0.2: U2.8 28.2,32.51 28.96,31.75 R9.1
N$24
  Top 0.2: U2.9 29.69,35.08 30.48,34.29 R8.1
N$25  (via drill 0.3 pad 0.5)
  Top 0.2: v54.61,43.69 43.69,43.69 42.93,42.93 42.93,39.88 42.42,39.37 SS.1
  Bottom 0.2: U1.RX v54.61,43.69
N$45
  Top 0.2: R10.1 L.C
RESET  (via drill 0.3 pad 0.5)
  Top 0.2: U2.24 22.6,47.5 22.35,47.75 v19.81,47.75
  Top 0.4: S2.4 4.32,28.57 | 4.32,28.57 S2.3 v7.62,29.72 | R3.1 4.23,28.49 4.32,28.57
  Bottom 0.2: v19.81,47.75 11.94,47.75 J2.5
  Bottom 0.4: v7.62,29.72 7.62,45.21 8.13,45.72 9.91,45.72 11.43,47.24 J2.5
REST-M64  (via drill 0.3 pad 0.5)
  Top 0.2: U$1.31 46.72,17.76 46.99,18.03 v46.99,21.08 | v45.72,24.38 J1.5 | S1.4 S1.3 58.14,23.6 57.4,22.86 R4.1 56.73,20.66 v56.64,20.57 | U1.RES 24.13,4.32 25.15,5.33 28.19,5.33 28.96,6.1 28.96,12.19 31.24,14.48 31.24,20.32 33.53,22.61 v33.78,22.61 | v38.1,23.11 v38.1,27.18
  Bottom 0.2: v56.64,20.57 54.61,20.57 53.59,19.56 53.59,18.03 53.09,17.53 47.75,17.53 46.99,18.29 v46.99,21.08 46.99,24.13 46.74,24.38 v45.72,24.38 43.18,24.38 40.39,27.18 v38.1,27.18 | v33.78,22.61 37.59,22.61 v38.1,23.11
RX  (via drill 0.3 pad 0.5)
  Top 0.2: U$1.12 39.37,16.76 39.12,16.51 v37.34,16.51 | v35.31,33.02 36.07,33.02 36.32,33.27 36.32,34.2 R8.2 36.41,35.39 38.61,37.59 38.61,41.15 39.37,41.91 SS.2
  Bottom 0.2: v37.34,16.51 36.83,16.51 36.58,16.76 36.58,18.29 36.32,18.54 33.27,18.54 32.77,19.05 32.77,32.77 33.02,33.02 v35.31,33.02
SCK  (via drill 0.3 pad 0.5)
  Top 0.2: U$1.28 47.5,16.26 48.01,16.76 48.77,16.76 49.28,17.27 v49.28,19.56 | U1.D13 20.32,49.53 19.05,48.26 19.05,44.7 18.53,44.18 L.A 18.54,43.18 19.3,42.42 v21.08,42.42 | v29.46,26.92 36.07,26.92 v37.08,27.94 | v41.66,33.78 v41.66,35.31 | v43.43,35.31 43.43,33.02 v43.94,32.51
  Bottom 0.2: v49.28,19.56 49.28,25.15 48.51,25.91 44.2,25.91 43.43,26.67 43.43,29.97 43.94,30.48 | 43.94,30.48 J1.3 | v21.08,42.42 21.59,42.42 23.11,40.89 24.64,40.89 27.43,38.1 27.43,35.05 27.94,34.54 27.94,27.94 28.96,26.92 v29.46,26.92 | v37.08,27.94 41.4,27.94 41.91,28.45 41.91,33.02 41.66,33.27 v41.66,33.78 | v41.66,35.31 v43.43,35.31 | v43.94,32.51 43.94,30.48
TX  (via drill 0.3 pad 0.5)
  Top 0.2: U$1.2 44.43,23.9 41.91,26.42 41.91,31.24 41.4,31.75 37.34,31.75 | 37.34,31.75 R9.2 | v53.85,44.45 43.18,44.45 41.4,46.23 39.37,46.23 38.35,45.21 38.35,42.93 v36.58,41.15 | v37.34,33.02 37.34,31.75
  Bottom 0.2: U1.TX 52.07,48.77 53.09,47.75 53.85,47.75 54.1,47.5 54.1,44.7 v53.85,44.45 | v36.58,41.15 36.58,33.78 v37.34,33.02
USBVCC  (via drill 0.3 pad 0.5)
  Top 0.2: PTC.2 18.54,39.37 18.8,39.12 18.8,30.48
  Top 0.4: C10.2 7.66,9.42 v7.62,9.18 | v7.62,13.46 8.13,13.97 C4.A 9.91,14.1 v9.91,15.49 | JP1.1 18.6,30.03 17.02,28.45 v17.02,25.4 | PWR.A 1.26,49.01 1.02,48.77 1.02,44.2 v1.52,43.69
  Top 0.6: PTC.2 18.6,39.37 18.6,36.1 | 18.6,36.1 JP1.1 | U2.31 18.6,36.1
  Bottom 0.4: v7.62,9.18 7.62,9.65 | 7.62,9.65 v7.62,13.46 | v17.02,25.4 15.24,25.4 14.48,24.64 14.48,17.27 13.72,16.51 10.92,16.51 v9.91,15.49 | v1.52,43.69 2.54,42.67 2.54,28.19 1.52,27.18 1.52,24.64 2.14,23.62 2.14,10.81 3.3,9.65 7.62,9.65
(copper drawn outside any net)
  shapes: Top area x4

### Text on the board
200bmp: PWMduino | D2A | TX CAN | RX CAN
201bmp: PB7 | PB0 | PB1 | PB2 | PB3 | PB4 | PB5 | PC0 | PC1 | PD0 | PD1 | PD2 | PD3 | PD4 | ON | AREF | 9 | 8 | 7 | 6 | 5 | 4 | 3 | 2 | 1 | 0 | . | 13 | 12 | 11 | 10 | GND | DIGITAL | SS | TX | RX | L | RX | TX | ICSP | . | RESET | * = PWM PORT | ANALOG IN | PD5 | PD6 | PB6 | PC4 | PC5 | PC6 | 14 | 15 | 16 | 17 | RESET | 3.3V | 5V | GND | GND | A0 | A1 | A2 | A3 | A4 | A5 | PC2 | PC3 | PC7 | PD7